# Altium schematic sheet Sheet5.SchDoc: Наименование
size 209 x 297 mm; ApprovedBy: Утвердил; CheckedBy: Проверил; Author: Разработал; CompanyName: Организация; DrawnBy: Н.Контр; Engineer: Т.Контр; SheetNumber: 5; SheetTotal: 6; PageSetup: Record=PageOptions|CenterHorizontal=True|CenterVertical=True|PrintScale=0.94|XCorrection=1.00|YCorrection=1.00|PrintKind=1|BorderSize=5000000|LeftOffset=0|BottomOffset=0|Orientation=1|PaperLength=1000|PaperWidth=1000|Scale=100|PaperSource=7|PrintQuality=-4|MediaType=1|DitherType=10|PaperKind=A4|PrintScaleMode=1; DecimalNumber: Децимальный номер; HeadOfSector: Нач. сектора; MainDevice: Перв.примен.; Name: Наименование; DocumentName: Sheet1.SCHDOC
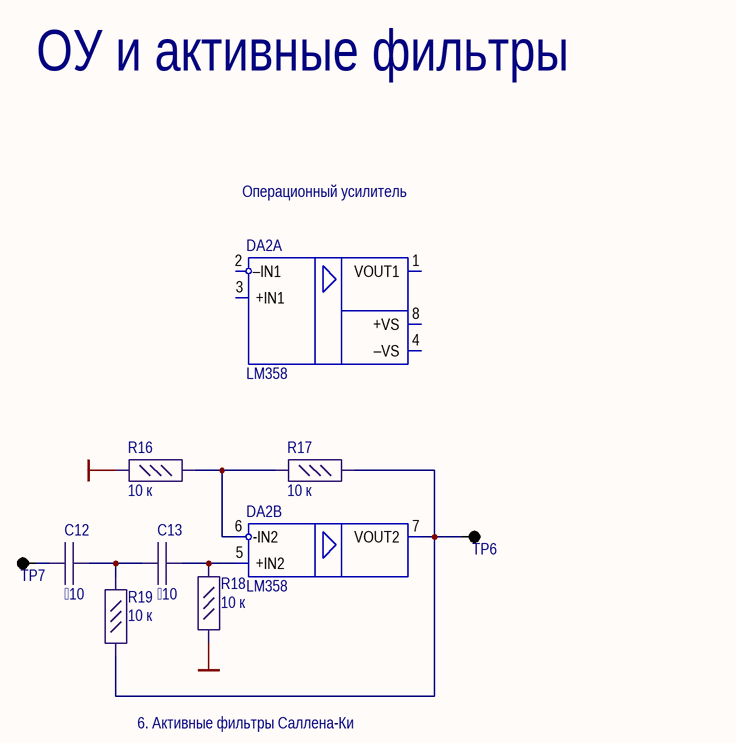
[diagram p0: Sheet5.SchDoc]

## Parts
C12  10  [C_0603]
C13  10  [C_0603]
DA2  LM358  [SO-8]  (parts A,B of 2)
R16  10 к  [R_0603]
R17  10 к  [R_0603]
R18  10 к  [R_0603]
R19  10 к  [R_0603]
TP6  Test_Point_1  [Test_point]  (value not drawn)
TP7  Test_Point_1  [Test_point]  (value not drawn)

## Nets
GND: R16.2 R18.2
NetC12_1: C12.1 TP7.1
NetC12_2: C12.2 C13.1 R19.1
NetC13_2: C13.2 DA2.5(+IN2) R18.1
NetDA2_6: DA2.6(-IN2) R16.1 R17.2
NetDA2_7: DA2.7(VOUT2) R17.1 R19.2 TP6.1

Not connected (* = marked no-connect by the designer): DA2 1(VOUT1) 2(–IN1) 3(+IN1) 4(–VS) 8(+VS)

## Notes on the sheet
- ОУ и активные фильтры
- Операционный усилитель
- 6. Активные фильтры Саллена-Ки
- Подп. и дата
- Инв.№ дубл.
- Взам.инв.№
- Подп.и дата
- Инв.№ подл.
- Изм.
- Лист
- № докум.
- Подп.
- Дата
- Формат  A4

## Library data of the parts
C12 C13 = GRM188R72A104KA35D: CAP CER 0.1UF 100V X7R 0603; Manufacturer: Murata Electronics; Value: 0.1µF; Part Number: GRM188R72A104KA35D; ComponentLink1URL: https://www.murata.com/~/media/webrenewal/support/library/catalog/products/capacitor/mlcc/c02e.ashx?la=en-us; ComponentLink1Description: Datasheet; Component Type: Capasitor
R16-R19 = CR0603-FX-1002ELF: RES SMD 10K OHM 1% 1/10W 0603; Manufacturer: Bourns Inc.; Part Number: CR0603-FX-1002ELF; Value: 10 к; ComponentLink1URL: https://www.bourns.com/pdfs/chpreztr.pdf; ComponentLink1Description: Datasheet; Component Type: Resistor